# EAGLE design pcb_maquina (EAGLE 7.6.0)

## Sheet 1 of 2
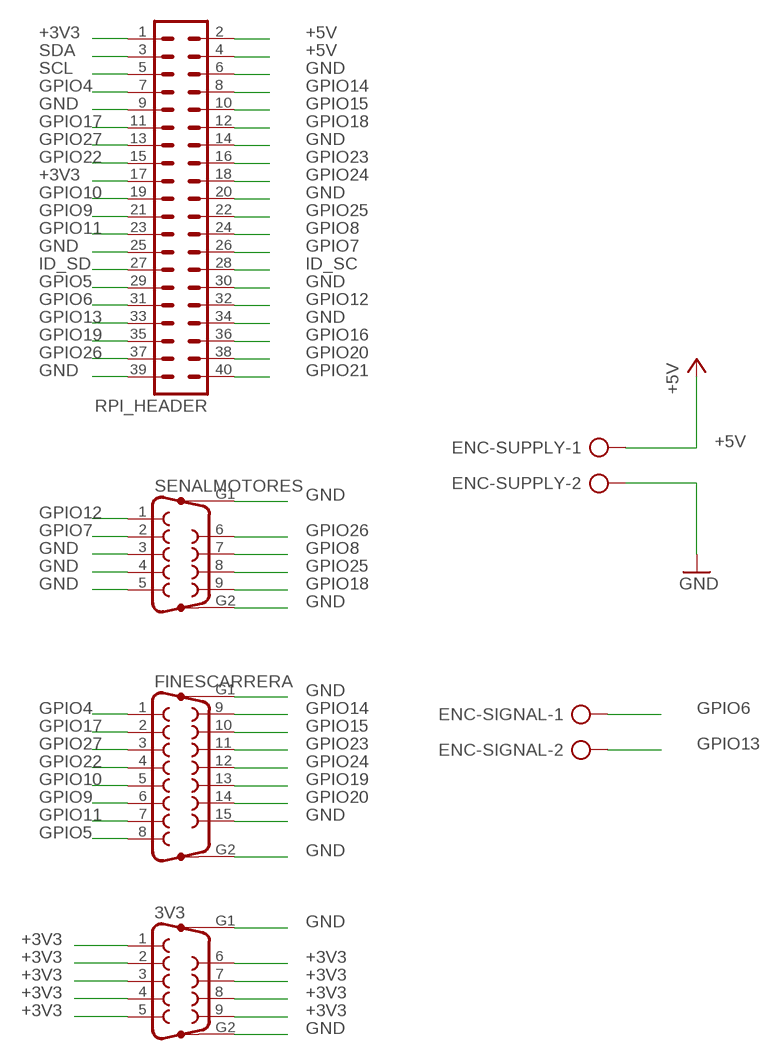
[diagram p0: schematic, sheet 1]

### Parts
3V3  F09HP  [F09HP]
ENC-SIGNAL  AK500/2  [AK500/2]
ENC-SUPPLY  AK500/2  [AK500/2]
FINESCARRERA  F15HP  [F15HP]
RPI_HEADER  MA20-2  [MA20-2]
SENALMOTORES  F09HP  [F09HP]

### Nets
+3V3: 3V3.1 3V3.2 3V3.3 3V3.4 3V3.5 3V3.6 3V3.7 3V3.8 3V3.9 RPI_HEADER.1 RPI_HEADER.17
+5V: ENC-SUPPLY.1 RPI_HEADER.2 RPI_HEADER.4 ; also sheet 2
GND: 3V3.G1 3V3.G2 ENC-SUPPLY.2 FINESCARRERA.15 FINESCARRERA.G1 FINESCARRERA.G2 RPI_HEADER.6 RPI_HEADER.9 RPI_HEADER.14 RPI_HEADER.20 RPI_HEADER.25 RPI_HEADER.30 RPI_HEADER.34 RPI_HEADER.39 SENALMOTORES.3 SENALMOTORES.4 SENALMOTORES.5 SENALMOTORES.G1 SENALMOTORES.G2 ; also sheet 2
GPIO4: FINESCARRERA.1 RPI_HEADER.7
GPIO5: FINESCARRERA.8 RPI_HEADER.29
GPIO6: ENC-SIGNAL.1 RPI_HEADER.31
GPIO7: RPI_HEADER.26 SENALMOTORES.2
GPIO8: RPI_HEADER.24 SENALMOTORES.7
GPIO9: FINESCARRERA.6 RPI_HEADER.21
GPIO10: FINESCARRERA.5 RPI_HEADER.19
GPIO11: FINESCARRERA.7 RPI_HEADER.23
GPIO12: RPI_HEADER.32 SENALMOTORES.1
GPIO13: ENC-SIGNAL.2 RPI_HEADER.33
GPIO14: FINESCARRERA.9 RPI_HEADER.8
GPIO15: FINESCARRERA.10 RPI_HEADER.10
GPIO16: RPI_HEADER.36 ; also sheet 2
GPIO17: FINESCARRERA.2 RPI_HEADER.11
GPIO18: RPI_HEADER.12 SENALMOTORES.9
GPIO19: FINESCARRERA.13 RPI_HEADER.35
GPIO20: FINESCARRERA.14 RPI_HEADER.38
GPIO21: RPI_HEADER.40 ; also sheet 2
GPIO22: FINESCARRERA.4 RPI_HEADER.15
GPIO23: FINESCARRERA.11 RPI_HEADER.16
GPIO24: FINESCARRERA.12 RPI_HEADER.18
GPIO25: RPI_HEADER.22 SENALMOTORES.8
GPIO26: RPI_HEADER.37 SENALMOTORES.6
GPIO27: FINESCARRERA.3 RPI_HEADER.13
ID_SC: RPI_HEADER.28
ID_SD: RPI_HEADER.27
SCL: RPI_HEADER.5 ; also sheet 2
SDA: RPI_HEADER.3 ; also sheet 2

## Sheet 2 of 2
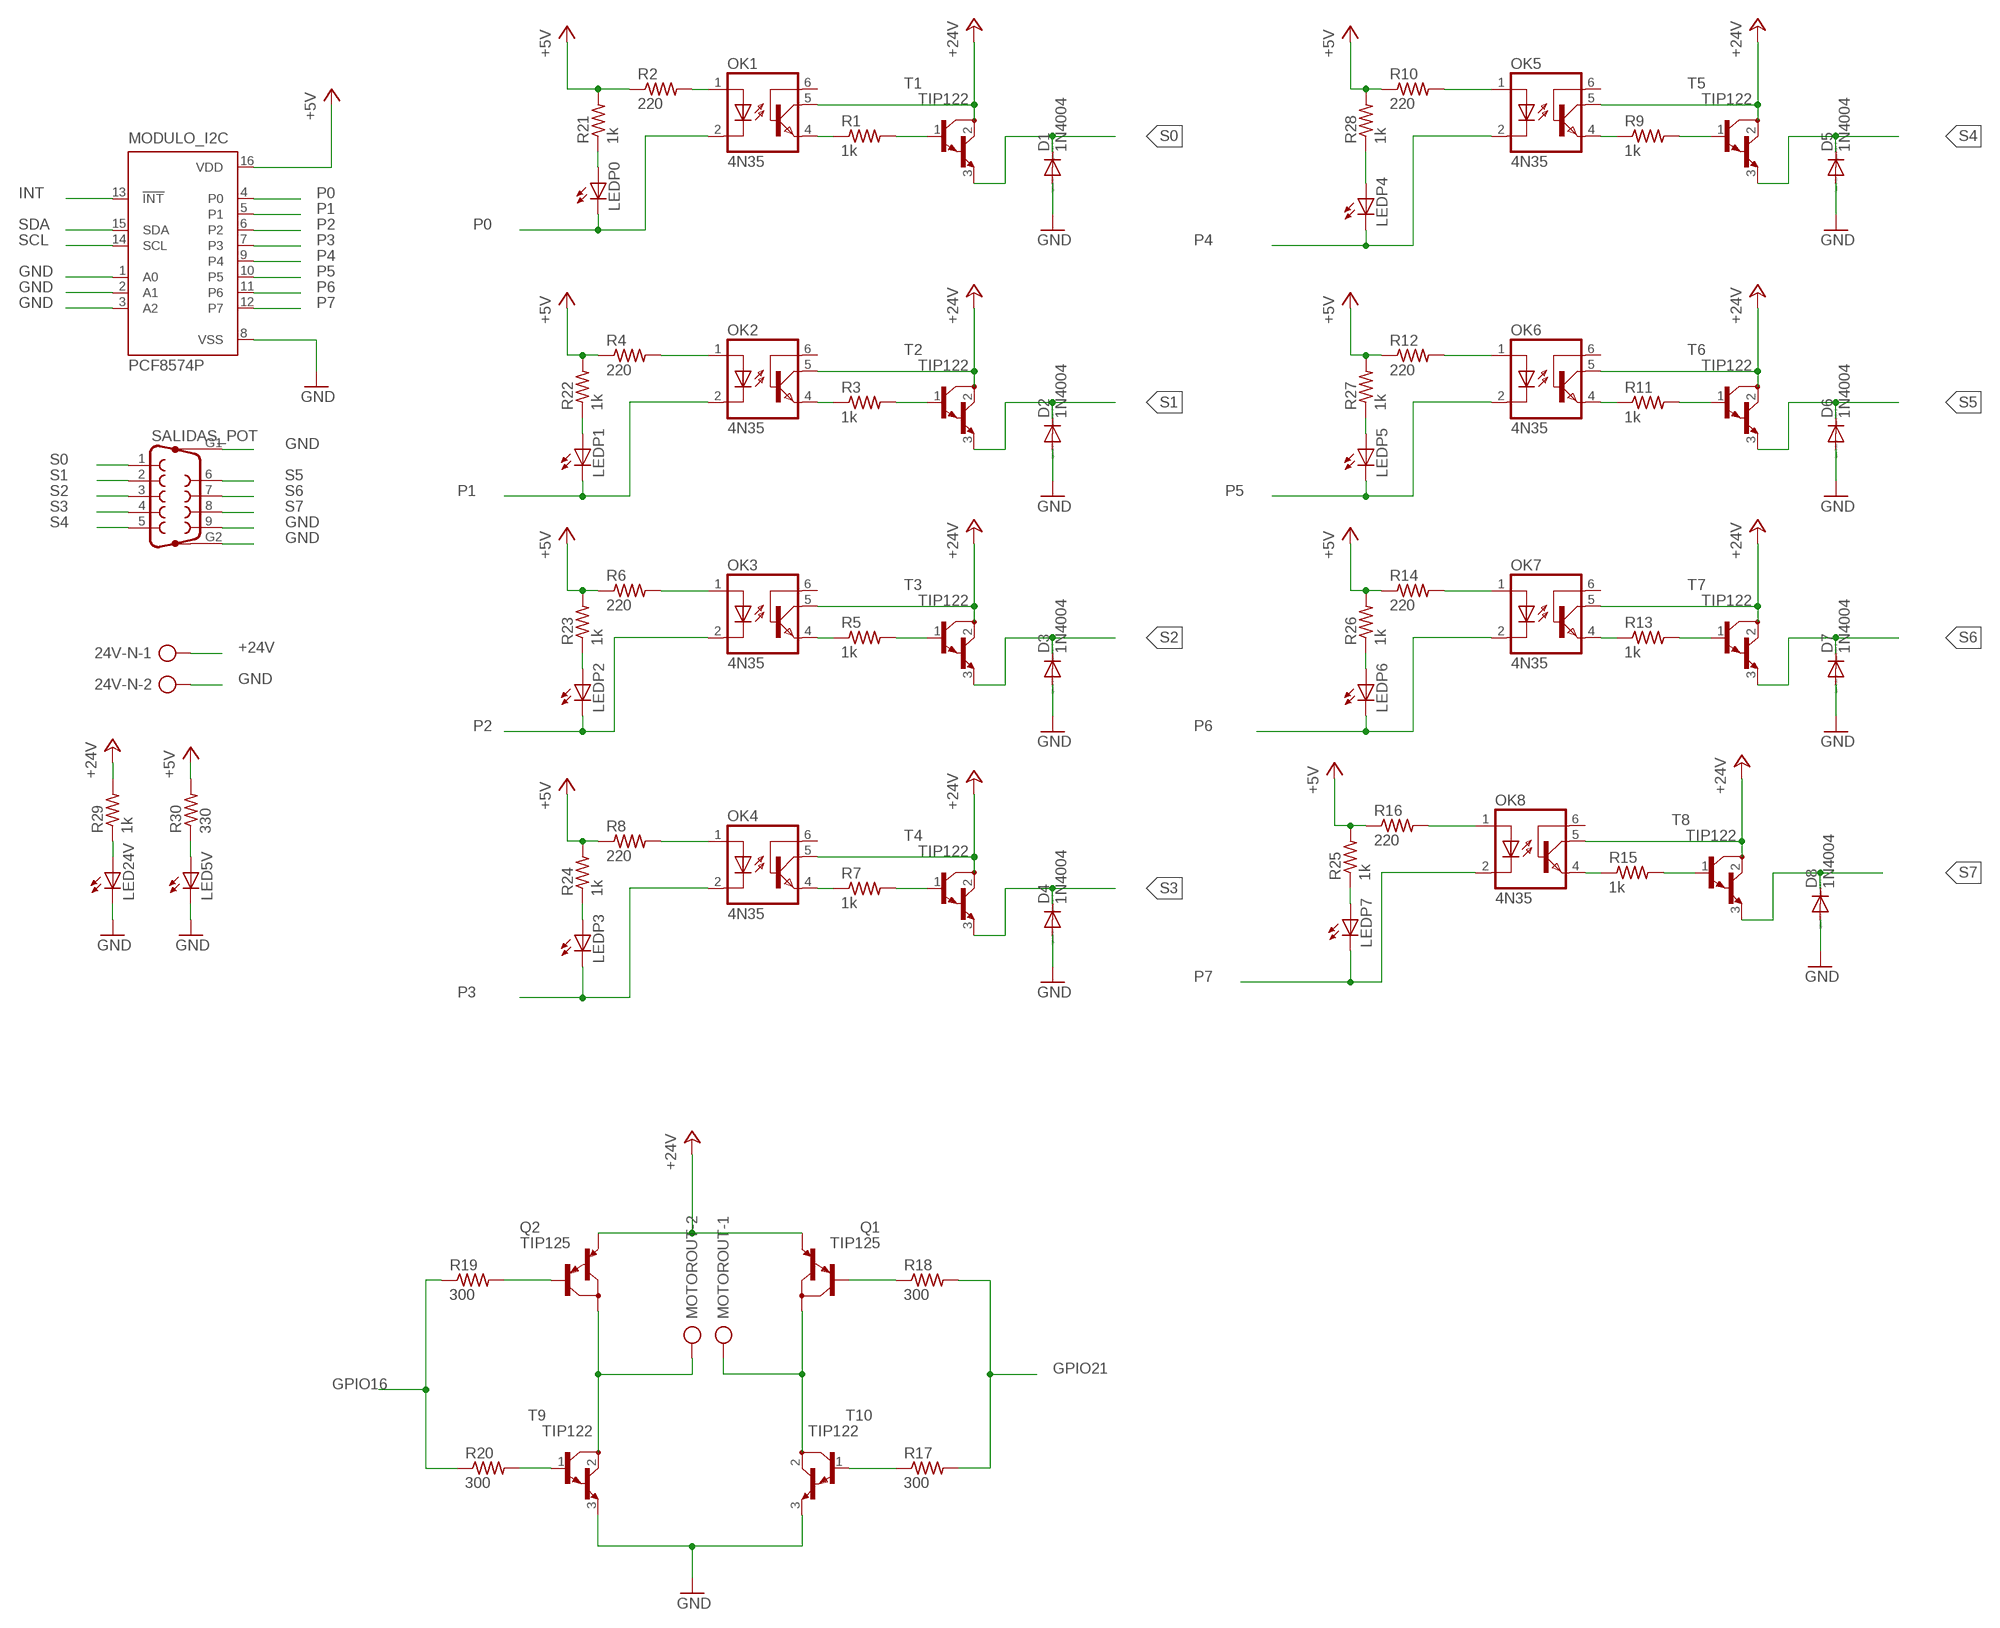
[diagram p1: schematic, sheet 2]

### Parts
24V-N  AK300/2  [AK300/2]
D1  1N4004  [DO41-10]
D2  1N4004  [DO41-10]
D3  1N4004  [DO41-10]
D4  1N4004  [DO41-10]
D5  1N4004  [DO41-10]
D6  1N4004  [DO41-10]
D7  1N4004  [DO41-10]
D8  1N4004  [DO41-10]
LED5V  LED3MM  [LED3MM]
LED24V  LED3MM  [LED3MM]
LEDP0  LED3MM  [LED3MM]
LEDP1  LED3MM  [LED3MM]
LEDP2  LED3MM  [LED3MM]
LEDP3  LED3MM  [LED3MM]
LEDP4  LED3MM  [LED3MM]
LEDP5  LED3MM  [LED3MM]
LEDP6  LED3MM  [LED3MM]
LEDP7  LED3MM  [LED3MM]
MODULO_I2C  PCF8574P  [DIL16]
MOTOROUT  AK300/2  [AK300/2]
OK1  4N35  [DIL06]
OK2  4N35  [DIL06]
OK3  4N35  [DIL06]
OK4  4N35  [DIL06]
OK5  4N35  [DIL06]
OK6  4N35  [DIL06]
OK7  4N35  [DIL06]
OK8  4N35  [DIL06]
Q1  TIP125  [TO220]
Q2  TIP125  [TO220]
R1  1k  R-US_0204/7  [0204/7]
R2  220  R-US_0204/7  [0204/7]
R3  1k  R-US_0204/7  [0204/7]
R4  220  R-US_0204/7  [0204/7]
R5  1k  R-US_0204/7  [0204/7]
R6  220  R-US_0204/7  [0204/7]
R7  1k  R-US_0204/7  [0204/7]
R8  220  R-US_0204/7  [0204/7]
R9  1k  R-US_0204/7  [0204/7]
R10  220  R-US_0204/7  [0204/7]
R11  1k  R-US_0204/7  [0204/7]
R12  220  R-US_0204/7  [0204/7]
R13  1k  R-US_0204/7  [0204/7]
R14  220  R-US_0204/7  [0204/7]
R15  1k  R-US_0204/7  [0204/7]
R16  220  R-US_0204/7  [0204/7]
R17  300  R-US_0204/7  [0204/7]
R18  300  R-US_0204/7  [0204/7]
R19  300  R-US_0204/7  [0204/7]
R20  300  R-US_0204/7  [0204/7]
R21  1k  R-US_0204/7  [0204/7]
R22  1k  R-US_0204/7  [0204/7]
R23  1k  R-US_0204/7  [0204/7]
R24  1k  R-US_0204/7  [0204/7]
R25  1k  R-US_0204/7  [0204/7]
R26  1k  R-US_0204/7  [0204/7]
R27  1k  R-US_0204/7  [0204/7]
R28  1k  R-US_0204/7  [0204/7]
R29  1k  R-US_0204/7  [0204/7]
R30  330  R-US_0204/7  [0204/7]
SALIDAS_POT  F09HP  [F09HP]
T1  TIP122  [TO220]
T2  TIP122  [TO220]
T3  TIP122  [TO220]
T4  TIP122  [TO220]
T5  TIP122  [TO220]
T6  TIP122  [TO220]
T7  TIP122  [TO220]
T8  TIP122  [TO220]
T9  TIP122  [TO220]
T10  TIP122  [TO220]

### Nets
+5V: MODULO_I2C.16(VDD) R2.1 R4.1 R6.1 R8.1 R10.1 R12.1 R14.1 R16.1 R21.2 R22.2 R23.2 R24.2 R25.2 R26.2 R27.2 R28.2 R30.2 ; also sheet 1
+24V [POTENCIA]: 24V-N.1 OK1.5(COL) OK2.5(COL) OK3.5(COL) OK4.5(COL) OK5.5(COL) OK6.5(COL) OK7.5(COL) OK8.5(COL) Q1.3(E) Q2.3(E) R29.2 T1.2(C) T2.2(C) T3.2(C) T4.2(C) T5.2(C) T6.2(C) T7.2(C) T8.2(C)
GND: 24V-N.2 D1.A D2.A D3.A D4.A D5.A D6.A D7.A D8.A LED5V.K(C) LED24V.K(C) MODULO_I2C.1(A0) MODULO_I2C.2(A1) MODULO_I2C.3(A2) MODULO_I2C.8(VSS) SALIDAS_POT.9 SALIDAS_POT.G1 SALIDAS_POT.G2 T9.3(E) T10.3(E) ; also sheet 1
GPIO16: R19.1 R20.1 ; also sheet 1
GPIO21: R17.2 R18.2 ; also sheet 1
INT: MODULO_I2C.13(!INT)
N$1: OK1.1(A) R2.2
N$2: Q1.1(B) R18.1
N$3: Q2.1(B) R19.2
N$4: R20.2 T9.1(B)
N$5 [POTENCIA]: MOTOROUT.2 Q2.2(C) T9.2(C)
N$6 [POTENCIA]: MOTOROUT.1 Q1.2(C) T10.2(C)
N$7: LEDP0.A R21.1
N$8: R17.1 T10.1(B)
N$9: LEDP1.A R22.1
N$10: OK2.1(A) R4.2
N$11: LEDP2.A R23.1
N$12 [POTENCIA]: OK1.4(EMI) R1.1
N$13 [POTENCIA]: R1.2 T1.1(B)
N$14: LEDP3.A R24.1
N$15: LEDP4.A R28.1
N$16 [POTENCIA]: OK2.4(EMI) R3.1
N$17 [POTENCIA]: R3.2 T2.1(B)
N$18: LEDP5.A R27.1
N$19: OK3.1(A) R6.2
N$20: LEDP6.A R26.1
N$21 [POTENCIA]: OK3.4(EMI) R5.1
N$22 [POTENCIA]: R5.2 T3.1(B)
N$23: LEDP7.A R25.1
N$24: OK4.1(A) R8.2
N$25: LED5V.A R30.1
N$26 [POTENCIA]: OK4.4(EMI) R7.1
N$27 [POTENCIA]: R7.2 T4.1(B)
N$28: LED24V.A R29.1
N$29: OK5.1(A) R10.2
N$31 [POTENCIA]: OK5.4(EMI) R9.1
N$32 [POTENCIA]: R9.2 T5.1(B)
N$34: OK6.1(A) R12.2
N$36 [POTENCIA]: OK6.4(EMI) R11.1
N$37 [POTENCIA]: R11.2 T6.1(B)
N$39: OK7.1(A) R14.2
N$41 [POTENCIA]: OK7.4(EMI) R13.1
N$42 [POTENCIA]: R13.2 T7.1(B)
N$44: OK8.1(A) R16.2
N$46 [POTENCIA]: OK8.4(EMI) R15.1
N$47 [POTENCIA]: R15.2 T8.1(B)
P0: LEDP0.K(C) MODULO_I2C.4(P0) OK1.2(C)
P1: LEDP1.K(C) MODULO_I2C.5(P1) OK2.2(C)
P2: LEDP2.K(C) MODULO_I2C.6(P2) OK3.2(C)
P3: LEDP3.K(C) MODULO_I2C.7(P3) OK4.2(C)
P4: LEDP4.K(C) MODULO_I2C.9(P4) OK5.2(C)
P5: LEDP5.K(C) MODULO_I2C.10(P5) OK6.2(C)
P6: LEDP6.K(C) MODULO_I2C.11(P6) OK7.2(C)
P7: LEDP7.K(C) MODULO_I2C.12(P7) OK8.2(C)
S0 [POTENCIA]: D1.C SALIDAS_POT.1 T1.3(E)
S1 [POTENCIA]: D2.C SALIDAS_POT.2 T2.3(E)
S2 [POTENCIA]: D3.C SALIDAS_POT.3 T3.3(E)
S3 [POTENCIA]: D4.C SALIDAS_POT.4 T4.3(E)
S4 [POTENCIA]: D5.C SALIDAS_POT.5 T5.3(E)
S5 [POTENCIA]: D6.C SALIDAS_POT.6 T6.3(E)
S6 [POTENCIA]: D7.C SALIDAS_POT.7 T7.3(E)
S7 [POTENCIA]: D8.C SALIDAS_POT.8 T8.3(E)
SCL: MODULO_I2C.14(SCL) ; also sheet 1
SDA: MODULO_I2C.15(SDA) ; also sheet 1
Unconnected: OK1.6(BAS) OK2.6(BAS) OK3.6(BAS) OK4.6(BAS) OK5.6(BAS) OK6.6(BAS) OK7.6(BAS) OK8.6(BAS)

## Library data of the parts
3V3 SALIDAS_POT SENALMOTORES = con-subd:F09HP: SUB-D; OC_FARNELL: unknown; OC_NEWARK: unknown
24V-N MOTOROUT = con-ptr500:AK300/2: CONNECTOR; OC_FARNELL: unknown; OC_NEWARK: unknown
D1-D8 = diode:1N4004: DIODE general purpose rectifier, 1 A
ENC-SIGNAL ENC-SUPPLY = con-ptr500:AK500/2: CONNECTOR; OC_FARNELL: unknown; OC_NEWARK: unknown
FINESCARRERA = con-subd:F15HP: SUB-D; OC_FARNELL: unknown; OC_NEWARK: unknown
LED5V LED24V LEDP0 LEDP1-LEDP7 = led:LED: LED OSRAM: - CHIPLED LG R971, LG N971, LY N971, LG Q971, LY Q971, LO R971, LY R971 LH N974, LH R974 LS Q976, LO Q976, LY Q976 LO Q996 - Hyper CHIPLED LW Q18S LB Q993, LB Q99A, LB R99A - SideLED LS A670, LO A670, LY A670, LG A670, LP A670 LB A673, LV A673, LT A673, LW A673 LH A674 LY A675 LS A676, LA A676, LO A676, LY A676, LW A676 LS A679, LY A679, LG A679 - Hyper Micro SIDELED® LS Y876, LA Y876, LO Y876, LY Y876 LT Y87S - SmartLED LW L88C, LW L88S LB L89C, LB L89S, LG L890 LS L89K, LO L89K, LY L89K LS L896, LA L896, LO L896, LY L896 - TOPLED LS T670, LO T670, LY T670, LG T670, LP T670 LSG T670, LSP T670, LSY T670, LOP T670, LYG T670 LG T671, LOG T671, LSG T671 LB T673, LV T673, LT T673, LW T673 LH T674 LS T676, LA T676, LO T676, LY T676, LB T676, LH T676, LSB T676, LW T676 LB T67C, LV T67C, LT T67C, LS T67K, LO T67K, LY T67K, LW E67C LS E67B, LA E67B, LO E67B, LY E67B, LB E67C, LV E67C, LT E67C LW T67C LS T679, LY T679, LG T679 LS T770, LO T770, LY T770, LG T770, LP T770 LB T773, LV T773, LT T773, LW T773 LH T774 LS E675, LA E675, LY E675, LS T675 LS T776, LA T776, LO T776, LY T776, LB T776 LHGB T686 LT T68C, LB T68C - Hyper Mini TOPLED® LB M676 - Mini TOPLED Santana® LG M470 LS M47K, LO M47K, LY M47K Source: http://www.osram.convergy.de LUXEON: - LUMILED® LXK2-PW12-R00, LXK2-PW12-S00, LXK2-PW14-U00, LXK2-PW14-V00 LXK2-PM12-R00, LXK2-PM12-S00, LXK2-PM14-U00 LXK2-PE12-Q00, LXK2-PE12-R00, LXK2-PE12-S00, LXK2-PE14-T00, LXK2-PE14-U00 LXK2-PB12-K00, LXK2-PB12-L00, LXK2-PB12-M00, LXK2-PB14-N00, LXK2-PB14-P00, LXK2-PB14-Q00 LXK2-PR12-L00, LXK2-PR12-M00, LXK2-PR14-Q00, LXK2-PR14-R00 LXK2-PD12-Q00, LXK2-PD12-R00, LXK2-PD12-S00 LXK2-PH12-R00, LXK2-PH12-S00 LXK2-PL12-P00, LXK2-PL12-Q00, LXK2-PL12-R00 Source: www.luxeon.com KINGBRIGHT: KA-3528ASYC Source: www.kingbright.com
MODULO_I2C = micro-philips:PCF8574: I2C-Bus Remote 8-bit I/O expander http://www.semiconductors.philips.com/acrobat_download/datasheets/PCF8574_4.pdf; MPN: PCF8574PN; OC_FARNELL: 204020; OC_NEWARK: 11N8515
OK1-OK8 = optocoupler:4N35: MOTOROLA OPTO COUPLER; MF: FAIRCHILD SEMICONDUCTOR; MPN: 4N35; OC_FARNELL: 1328375; OC_NEWARK: 72K9946
Q1 Q2 = transistor-pnp:TIP125: PNP Transistor
R1-R30 = resistor:R-US_: RESISTOR, American symbol
RPI_HEADER = con-lstb:MA20-2: PIN HEADER; OC_FARNELL: unknown; OC_NEWARK: unknown
T1-T10 = transistor:TIP122: NPN BIPOLAR DARLINGTON TRANSISTOR

## Net classes
0 default: width 0.406 mm
1 POTENCIA: width 0.635 mm, clearance 0.254 mm

## Board
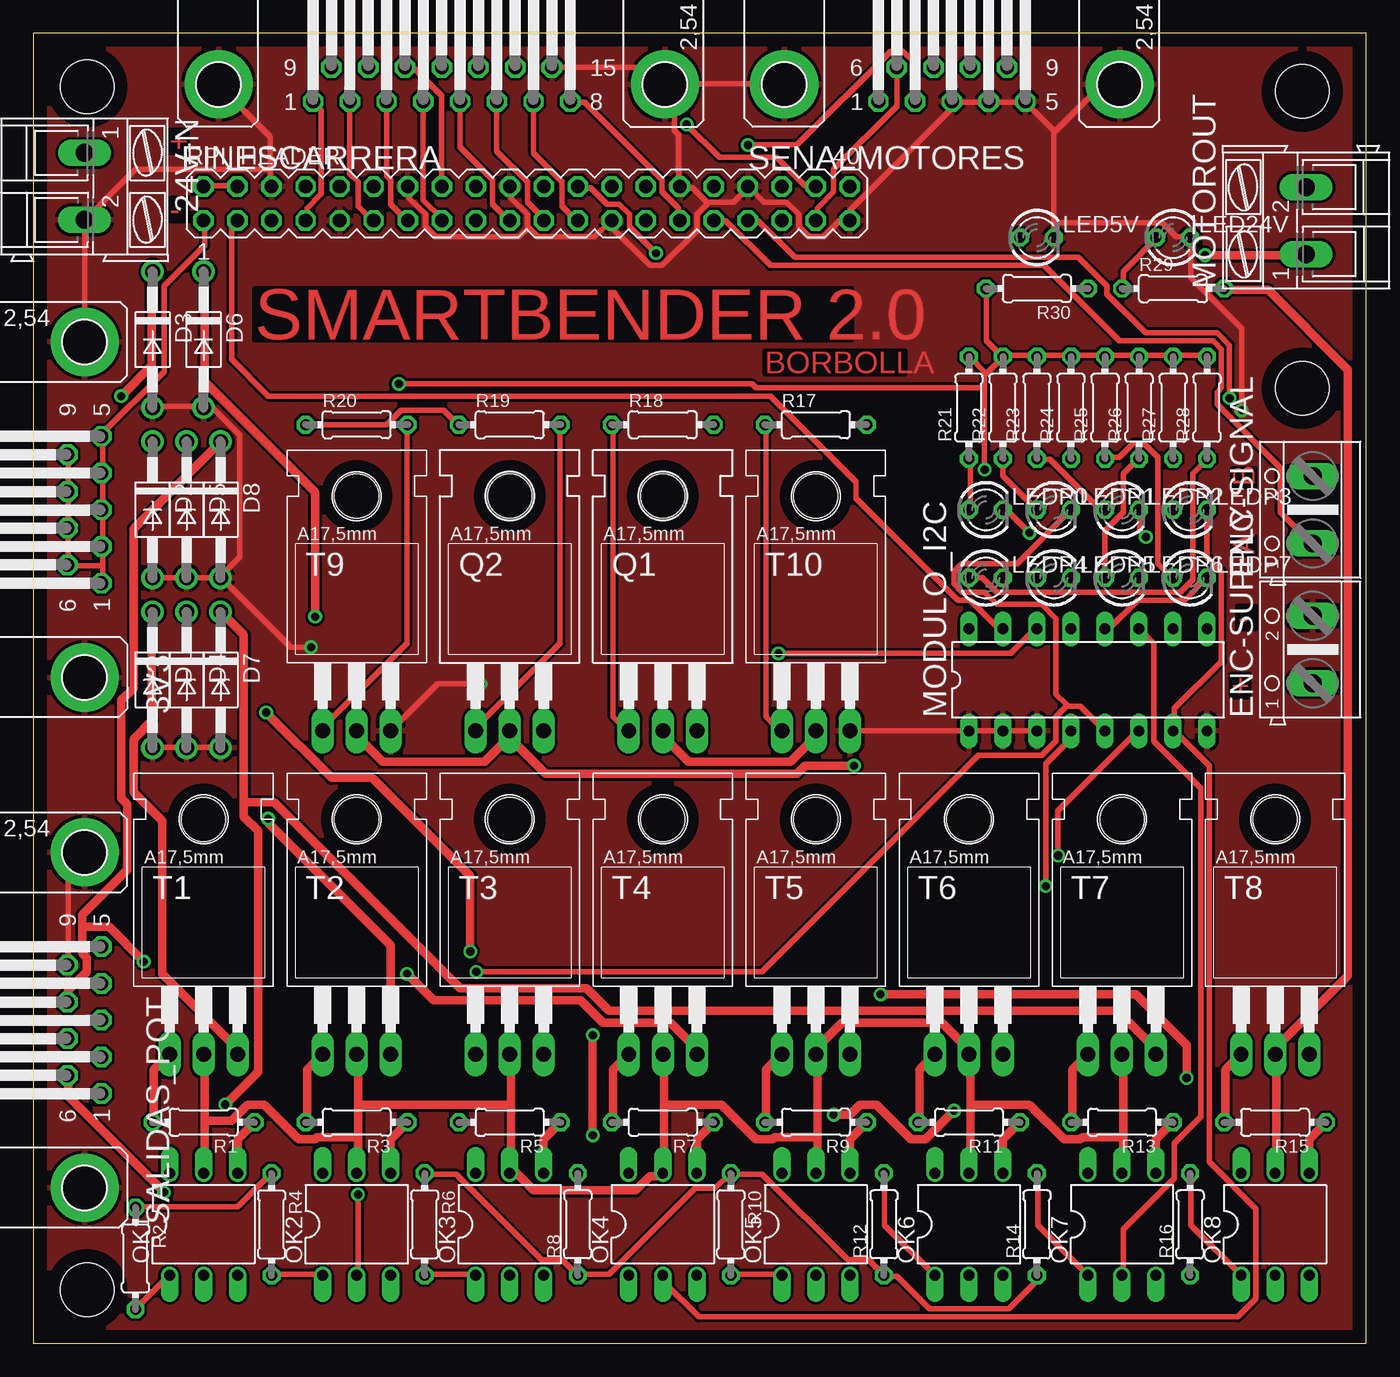
[diagram p2: board, top side]
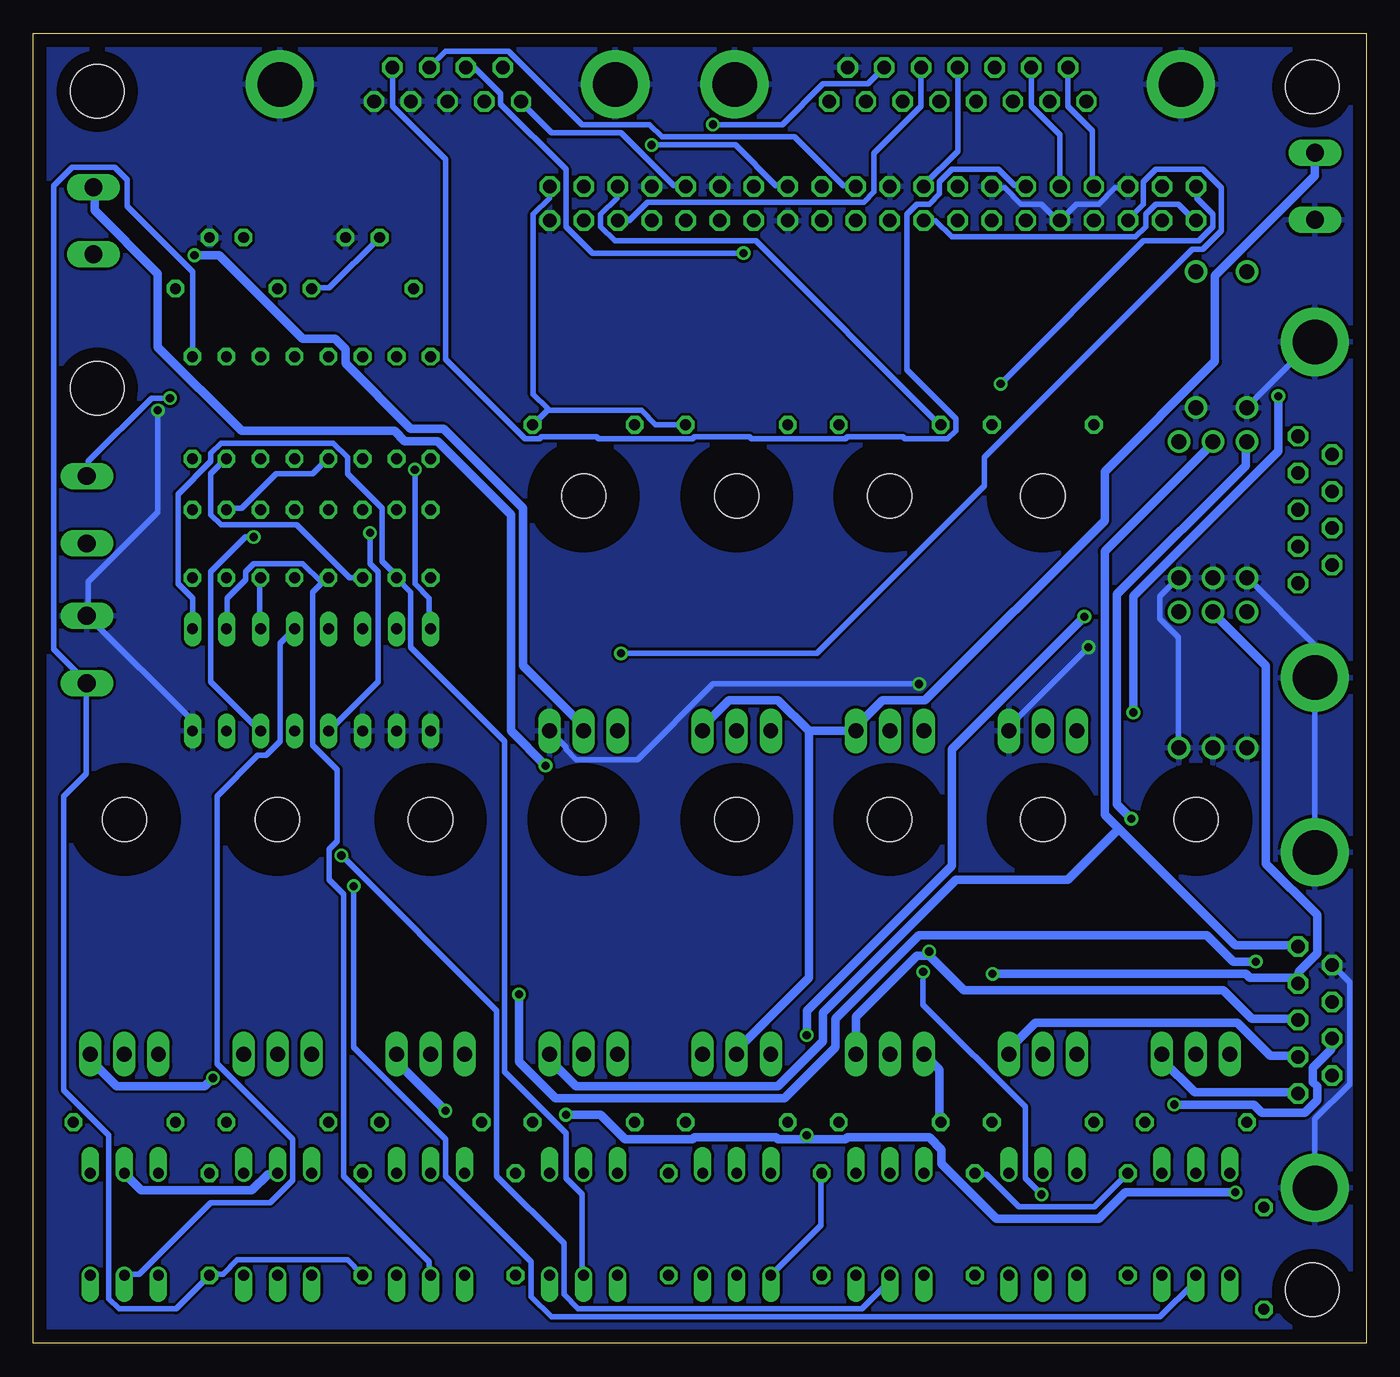
[diagram p3: board, bottom side, seen from below]

Size 99.5 x 97.78 mm. Coordinates in mm from the lower left corner, seen from the top.
Outline: 0,0 99.5,0 99.5,97.78 0,97.78 0,0
Copper layers (1*16): Top 0.035mm / dielectric 1.5mm / Bottom 0.035mm
Design rules "default": minimum track width 10mil, minimum drill 24mil, track to track 8mil, track to pad 8mil, pad to pad 8mil, via to via 8mil, smd to smd 8mil, copper to edge 40mil, drill to drill 8mil, minimum pad ring 10mil, minimum via ring 8mil, stop-mask expansion 4mil, vias tented up to drill 0mil, thermal gap 10mil
Holes 4 mm at 4,93.8 4,4 94.73,71.31 94.73,93.46

### Footprints (pad centres in the part's own frame; a part is rotated, then mirrored left to right if it is on the bottom)
F09HP = drill 1.016 octagon: 1 -5.486,-1.27; 2 -2.743,-1.27; 3 0,-1.27; 4 2.743,-1.27; 5 5.486,-1.27; 6 -4.115,1.27; 7 -1.372,1.27; 8 1.372,1.27; 9 4.115,1.27 | drill 3.302 pad 5.08: G1 -12.522,0; G2 12.522,0
AK300/2 = drill 1.321 long: 1 -2.515,0; 2 2.489,0
DO41-10 = drill 1.118: A 5.08,0; C -5.08,0
AK500/2 = drill 1.321 long: 1 -2.515,0; 2 2.515,0
F15HP = drill 1.016 octagon: 1 -9.601,-1.27; 2 -6.858,-1.27; 3 -4.115,-1.27; 4 -1.372,-1.27; 5 1.372,-1.27; 6 4.115,-1.27; 7 6.858,-1.27; 8 9.601,-1.27; 9 -8.23,1.27; 10 -5.486,1.27; 11 -2.743,1.27; 12 0,1.27; 13 2.743,1.27; 14 5.486,1.27; 15 8.23,1.27 | drill 3.302 pad 5.08: G1 -16.662,0; G2 16.662,0
LED3MM = drill 0.813 octagon: A -1.27,0; K 1.27,0
DIL16 = drill 0.813 long: 1 -8.89,-3.81; 2 -6.35,-3.81; 3 -3.81,-3.81; 4 -1.27,-3.81; 5 1.27,-3.81; 6 3.81,-3.81; 7 6.35,-3.81; 8 8.89,-3.81; 9 8.89,3.81; 10 6.35,3.81; 11 3.81,3.81; 12 1.27,3.81; 13 -1.27,3.81; 14 -3.81,3.81; 15 -6.35,3.81; 16 -8.89,3.81
DIL06 = drill 0.813 offset: 1 -2.54,-3.81; 2 0,-3.81; 3 2.54,-3.81; 4 2.54,3.81; 5 0,3.81; 6 -2.54,3.81
TO220 = drill 1.118 long: 1 -2.54,-6.35; 2 0,-6.35; 3 2.54,-6.35 | hole 3.302: 0,11.176
0204/7 = drill 0.813 octagon: 1 -3.81,0; 2 3.81,0
MA20-2 = drill 1.016 octagon: 1 -24.13,-1.27; 2 -24.13,1.27; 3 -21.59,-1.27; 4 -21.59,1.27; 5 -19.05,-1.27; 6 -19.05,1.27; 7 -16.51,-1.27; 8 -16.51,1.27; 9 -13.97,-1.27; 10 -13.97,1.27; 11 -11.43,-1.27; 12 -11.43,1.27; 13 -8.89,-1.27; 14 -8.89,1.27; 15 -6.35,-1.27; 16 -6.35,1.27; 17 -3.81,-1.27; 18 -3.81,1.27; 19 -1.27,-1.27; 20 -1.27,1.27; 21 1.27,-1.27; 22 1.27,1.27; 23 3.81,-1.27; 24 3.81,1.27; 25 6.35,-1.27; 26 6.35,1.27; 27 8.89,-1.27; 28 8.89,1.27; 29 11.43,-1.27; 30 11.43,1.27; 31 13.97,-1.27; 32 13.97,1.27; 33 16.51,-1.27; 34 16.51,1.27; 35 19.05,-1.27; 36 19.05,1.27; 37 21.59,-1.27; 38 21.59,1.27; 39 24.13,-1.27; 40 24.13,1.27

### Placement (x,y rotation side)
3V3  3.81,62.23 90 top
24V-N  3.81,86.36 270 top
D1  8.89,49.53 270 top
D2  8.89,62.23 270 top
D3  8.89,74.93 270 top
D4  11.43,49.53 270 top
D5  11.43,62.23 270 top
D6  12.7,74.93 270 top
D7  13.97,49.53 270 top
D8  13.97,62.23 270 top
ENC-SIGNAL  95.52,62.23 90 top
ENC-SUPPLY  95.52,51.8 90 top
FINESCARRERA  30.48,93.98 0 top
LED5V  74.93,82.55 0 top
LED24V  85.09,82.55 0 top
LEDP0  71.12,62.23 0 top
LEDP1  76.2,62.23 0 top
LEDP2  81.28,62.23 0 top
LEDP3  86.36,62.23 0 top
LEDP4  71.12,57.15 0 top
LEDP5  76.2,57.15 0 top
LEDP6  81.28,57.15 0 top
LEDP7  86.36,57.15 0 top
MODULO_I2C  78.74,49.53 0 top
MOTOROUT  95.02,83.82 90 top
OK1  12.7,8.89 0 top
OK2  24.13,8.89 0 top
OK3  35.56,8.89 0 top
OK4  46.99,8.89 0 top
OK5  58.42,8.89 0 top
OK6  69.85,8.89 0 top
OK7  81.28,8.89 0 top
OK8  92.71,8.89 0 top
Q1  46.99,52.07 0 top
Q2  35.56,52.07 0 top
R1  12.7,16.51 180 top
R2  7.62,6.35 270 top
R3  24.13,16.51 180 top
R4  17.78,8.89 270 top
R5  35.56,16.51 180 top
R6  29.21,8.89 270 top
R7  46.99,16.51 180 top
R8  40.64,8.89 90 top
R9  58.42,16.51 180 top
R10  52.07,8.89 270 top
R11  69.85,16.51 180 top
R12  63.5,8.89 90 top
R13  81.28,16.51 180 top
R14  74.93,8.89 90 top
R15  92.71,16.51 180 top
R16  86.36,8.89 90 top
R17  58.42,68.58 0 top
R18  46.99,68.58 0 top
R19  35.56,68.58 0 top
R20  24.13,68.58 0 top
R21  69.85,69.85 90 top
R22  72.39,69.85 90 top
R23  74.93,69.85 90 top
R24  77.47,69.85 90 top
R25  80.01,69.85 90 top
R26  82.55,69.85 90 top
R27  85.09,69.85 90 top
R28  87.63,69.85 90 top
R29  85.09,78.74 0 top
R30  74.93,78.74 180 top
RPI_HEADER  36.83,85.09 0 top
SALIDAS_POT  3.81,24.13 90 top
SENALMOTORES  68.58,93.98 0 top
T1  12.7,27.94 0 top
T2  24.13,27.94 0 top
T3  35.56,27.94 0 top
T4  46.99,27.94 0 top
T5  58.42,27.94 0 top
T6  69.85,27.94 0 top
T7  81.28,27.94 0 top
T8  92.71,27.94 0 top
T9  24.13,52.07 0 top
T10  58.42,52.07 0 top

### Tracks (layer width: path | path; a pad name or v marks a point on that pad's centre or on a via)
+3V3
  Top 0.406: 5.18,58.06 5.18,59.44 3V3.2 5.18,59.59 5.18,62.18 3V3.3 5.18,62.33 5.18,64.92 3V3.4 5.18,65.08 5.18,67.67 3V3.5 5.03,67.82 9.75,72.54 9.75,78.94 12.8,81.99 12.8,83.82 RPI_HEADER.1 | 5.18,58.06 5.18,56.84 3V3.1 | 5.18,58.06 2.59,58.06 3V3.6 2.59,58.22 2.59,60.81 3V3.7 2.59,60.96 2.59,63.55 3V3.8 2.59,63.7 2.59,66.29 3V3.9
  Bottom 0.406: RPI_HEADER.17 32.16,83.82 30.94,82.6 17.22,82.6 16.46,83.36 16.46,84.28 15.7,85.04 14.02,85.04 12.8,83.82 RPI_HEADER.1
+5V  (via drill 0.61)
  Top 0.406: R28.2 87.63,73.76 85.19,73.76 R27.2 85.04,73.76 82.6,73.76 R26.2 82.45,73.76 80.16,73.76 R25.2 80.01,73.76 77.57,73.76 R24.2 77.42,73.76 74.98,73.76 R23.2 74.83,73.76 72.54,73.76 R22.2 | RPI_HEADER.2 12.8,86.41 15.24,86.41 RPI_HEADER.4 | 71.02,72.39 71.02,72.54 69.95,73.61 R21.2 | 71.02,72.39 71.02,71.32 | 71.02,71.32 v71.02,65.23 | R22.2 72.39,73.61 71.17,72.39 71.02,72.39 | R30.2 71.17,78.64 71.17,74.83 72.24,73.76 R22.2 | v27.28,71.63 53.65,71.63 53.95,71.32 71.02,71.32 | R2.1 7.62,10.21 15.24,10.21 17.68,12.65 R4.1 | R14.1 74.83,5.03 74.83,4.57 72.85,2.59 66.9,2.59 64.47,5.03 63.55,5.03 R12.1 62.33,6.25 60.81,6.25 54.41,12.65 52.12,12.65 R10.1 51.97,12.65 50.9,11.58 49.38,11.58 42.98,5.18 40.69,5.18 R8.1 39.47,6.25 37.95,6.25 31.55,12.65 29.26,12.65 R6.1
  Bottom 0.406: v71.02,65.23 71.02,56.69 69.95,55.63 69.95,53.34 MODULO_I2C.16 | v27.28,71.63 16.61,82.3 12.5,82.3 11.43,83.36 11.43,84.28 12.65,85.5 12.65,86.26 RPI_HEADER.2 | R4.1 20.27,10.21 25.91,10.21 28.35,12.65 29.11,12.65 R6.1 | R14.1 74.98,5.18 76.05,6.25 84.28,6.25 85.34,5.18 86.26,5.18 R16.1 88.85,2.59 93.12,2.59 93.88,3.35 93.88,15.54 97.23,18.9 97.23,40.84 95.56,42.52 95.56,49.23 ENC-SUPPLY.1 95.56,49.38 97.99,51.82 97.99,86.41 96.62,87.78 93.42,87.78 92.51,86.87 92.51,84.89 87.63,80.01 R28.2
+24V
  Top 0.635: 58.52,15.39 58.52,21.49 T5.2 58.52,21.79 58.52,22.1 60.35,23.93 67.82,23.93 69.95,21.79 T6.2 69.95,21.49 69.95,17.83 | 58.52,15.39 58.52,12.8 OK5.5 | 47.09,17.83 47.09,21.49 T4.2 | 47.09,17.83 47.09,12.8 OK4.5 46.79,12.5 46.02,12.5 44.96,11.43 37.34,11.43 35.97,12.8 OK3.5 35.66,12.8 35.66,17.83 | 35.66,17.83 35.66,21.49 T3.2 | 12.8,16.61 12.8,21.49 T1.2 | 12.8,16.61 12.8,12.8 OK1.5 | 24.23,17.83 24.23,21.49 T2.2 | 24.23,17.83 24.23,15.39 | 24.23,15.39 24.23,12.8 OK2.5 | 12.8,16.61 14.78,16.61 16,17.83 17.22,17.83 19.81,15.24 21.03,15.24 21.18,15.39 24.23,15.39 | 24.23,17.83 35.66,17.83 | 58.52,15.39 55.32,15.39 55.17,15.24 53.95,15.24 51.36,17.83 47.09,17.83 | 69.95,17.83 69.95,12.8 OK6.5 | 81.38,15.39 81.38,21.49 T7.2 | 81.38,15.39 81.38,12.8 OK7.5 | 69.95,17.83 74.37,17.83 76.96,15.24 78.18,15.24 78.33,15.39 81.38,15.39 | OK8.5 92.81,12.8 92.81,21.49 T8.2 92.51,21.79 98.15,27.43 98.15,72.69 92.2,78.64 89,78.64 R29.2
  Bottom 0.635: 41.6,45.72 Q2.3 38.1,46.02 36.12,48.01 32.92,48.01 19.51,61.42 19.51,65.08 11.28,73.3 11.28,79.7 3.81,87.17 24V-N.1 | 41.6,45.72 43.89,48.01 47.55,48.01 49.53,46.02 Q1.3 | OK8.5 91.44,11.43 83.21,11.43 81.99,12.65 81.38,12.65 OK7.5 | 41.6,45.72 41.6,27.28 46.94,21.95 46.94,21.64 T4.2
GND  (via drill 0.61)
  Top 0.406: 17.68,87.63 17.68,90.07 13.87,93.88 FINESCARRERA.G1 | 17.68,87.63 17.68,86.41 RPI_HEADER.6 | 36.88,83.36 36.88,84.28 35.66,85.5 35.66,86.26 RPI_HEADER.20 | 36.88,83.36 37.64,82.6 41.91,82.6 43.13,83.82 RPI_HEADER.25 42.98,83.52 46.02,80.47 46.94,80.47 49.53,83.06 49.53,84.28 50.29,85.04 50.29,85.19 | 50.29,85.19 49.23,86.26 48.31,86.26 RPI_HEADER.30 48.16,86.41 48.16,90.22 47.85,90.53 47.85,93.88 FINESCARRERA.G2 | 50.29,85.19 52.27,85.19 53.34,86.26 RPI_HEADER.34 53.49,86.26 54.56,85.19 56.24,85.19 57.15,84.28 57.15,83.36 57.91,82.6 58.98,82.6 60.2,83.82 RPI_HEADER.39 60.96,84.58 68.89,92.51 SENALMOTORES.3 68.58,92.66 71.32,92.66 SENALMOTORES.4 71.48,92.66 73.91,92.66 SENALMOTORES.5 74.07,92.66 76.2,90.53 | FINESCARRERA.15 45.87,95.25 FINESCARRERA.G2 | SENALMOTORES.G1 55.93,94.03 47.24,94.03 FINESCARRERA.G2 | RPI_HEADER.14 28.04,86.26 28.04,85.5 29.26,84.28 29.26,83.36 30.02,82.6 36.27,82.6 36.88,83.21 36.88,83.36 | 76.2,90.53 76.2,83.67 | 76.2,83.67 LED5V.K | 76.2,83.67 84.28,83.67 85.34,82.6 86.26,82.6 LED24V.K 86.41,82.45 86.41,79.55 90.22,75.74 v90.22,69.65 | SENALMOTORES.G2 81.08,93.88 79.7,93.88 76.35,90.53 76.2,90.53 | SALIDAS_POT.9 2.59,28.35 2.59,35.36 3.81,36.58 SALIDAS_POT.G2 | D3.A 8.99,69.95 12.65,69.95 D6.A 12.8,69.8 13.41,69.8 15.39,67.82 15.39,58.67 14.02,57.3 D8.A | 3V3.G2 24V-N.2 3.96,83.97 7.62,87.63 17.68,87.63 | MODULO_I2C.3 MODULO_I2C.2 MODULO_I2C.1 T10.3 | D1.A 8.99,44.5 11.43,44.5 D4.A 11.58,44.5 13.87,44.5 D7.A | D2.A D5.A D8.A | v20.73,51.97 19.2,51.97 14.02,57.15 D8.A | v33.38,49.23 30.18,49.23 T9.3
  Bottom 0.406: RPI_HEADER.6 17.83,86.26 18.75,86.26 19.96,85.04 21.64,85.04 RPI_HEADER.9 23.01,83.82 24.23,85.04 25.76,85.04 26.98,86.26 27.89,86.26 RPI_HEADER.14 | MODULO_I2C.8 87.63,46.48 95.4,54.25 ENC-SUPPLY.2 95.4,54.41 95.4,56.84 90.22,62.03 v90.22,69.65 | SALIDAS_POT.G1 3.81,16.76 1.22,19.36 1.22,26.98 2.44,28.19 SALIDAS_POT.9 | D3.A 8.84,69.95 4.12,74.68 3.81,74.68 3V3.G2 | T9.3 26.67,46.02 v20.73,51.97 | D7.A 14.02,44.5 14.02,52.73 15.39,54.1 15.39,55.78 14.02,57.15 D8.A | T10.3 59.74,44.5 59.74,44.35 58.98,43.59 54.41,43.59 48.77,49.23 v33.38,49.23 | D2.A 8.84,57.15 3.81,52.12 3V3.G1 SALIDAS_POT.G2
  pour Bottom: -0.5,-0.5 -1,-0.5 -1,99 101.5,99 102,99 102,-2 -0.5,-2
  pour Top: -5,101 -5,-8 106.5,-8 111,-8 111,101
GPIO4
  Top 0.406: RPI_HEADER.7 20.42,83.82 20.42,84.73 21.49,85.8 21.49,92.05 20.88,92.66 FINESCARRERA.1
GPIO5
  Top 0.406: RPI_HEADER.29 48.16,83.82 48.16,84.73 46.94,85.95 46.94,86.87 41.15,92.66 40.08,92.66 FINESCARRERA.8
GPIO6
  Top 0.406: RPI_HEADER.31 51.66,83.82 55.02,80.47 75.44,80.47 81.08,74.83 88.09,74.83 88.7,74.22 88.7,71.32 88.39,71.02 88.39,70.1 93.12,65.38 93.12,62.03 95.4,59.74 ENC-SIGNAL.1
GPIO7  (via drill 0.61)
  Top 0.406: v53.34,89.46 57,89.46 64.01,96.47 64.92,96.47 65.84,95.56 SENALMOTORES.2
  Bottom 0.406: v53.34,89.46 47.09,89.46 44.04,86.41 43.28,86.41 RPI_HEADER.26
GPIO8  (via drill 0.61)
  Top 0.406: v46.48,81.38 44.5,83.36 44.5,84.28 43.74,85.04 42.82,85.04 41.6,86.26 40.69,86.26 RPI_HEADER.24
  Bottom 0.406: v46.48,81.38 57.76,81.38 59.74,83.36 59.74,87.63 64.62,92.51 64.62,93.27 66.6,95.25 SENALMOTORES.7
GPIO9
  Top 0.406: FINESCARRERA.6 34.59,89 36.88,86.72 36.88,85.19 38.1,83.97 RPI_HEADER.21
GPIO10
  Top 0.406: FINESCARRERA.5 31.85,89.31 34.29,86.87 34.29,85.04 35.51,83.82 RPI_HEADER.19
GPIO11
  Top 0.406: FINESCARRERA.7 37.34,88.85 39.47,86.72 39.47,84.89 40.54,83.82 RPI_HEADER.23
GPIO12
  Bottom 0.406: RPI_HEADER.32 50.9,86.41 51.66,86.41 55.63,90.37 60.81,90.37 63.09,92.66 SENALMOTORES.1
GPIO13  (via drill 0.61)
  Top 0.406: RPI_HEADER.33 54.1,83.82 56.84,81.08 78.03,81.08 80.16,78.94 80.16,78.33 83.06,75.44 88.39,75.44 89.31,74.52 v89.31,70.56
  Bottom 0.406: v89.31,70.56 90.68,70.56 95.4,65.84 95.4,64.77 ENC-SIGNAL.2
GPIO14
  Bottom 0.406: FINESCARRERA.9 22.25,92.35 20.42,90.53 20.42,86.41 RPI_HEADER.8
GPIO15
  Bottom 0.406: RPI_HEADER.10 22.86,90.22 24.99,92.35 FINESCARRERA.10
GPIO16
  Top 0.406: R20.1 26.36,68.58 27.43,69.65 30.63,69.65 31.7,68.58 R19.1
  Bottom 0.406: RPI_HEADER.36 55.93,86.26 55.93,85.5 57.15,84.28 57.15,83.36 56.08,82.3 45.57,82.3 31.85,68.58 R19.1
GPIO17
  Top 0.406: FINESCARRERA.2 23.62,87.33 24.23,86.72 24.23,84.89 25.3,83.82 RPI_HEADER.11
GPIO18
  Bottom 0.406: SENALMOTORES.9 72.69,92.35 68.73,88.39 68.73,73.46 62.79,67.51 61.72,67.51 61.57,67.67 57.45,67.67 57.3,67.51 50.29,67.51 50.14,67.67 46.02,67.67 45.87,67.51 38.86,67.51 38.71,67.67 34.59,67.67 34.44,67.51 31.24,67.51 30.63,68.12 30.63,69.04 34.29,72.69 34.29,84.28 33.53,85.04 32.61,85.04 31.85,85.8 31.85,86.72 30.94,87.63 27.43,87.63 26.21,86.41 25.45,86.41 RPI_HEADER.12
GPIO19
  Bottom 0.406: RPI_HEADER.35 55.02,83.82 53.65,85.19 37.49,85.19 36.73,85.95 36.73,88.85 33.22,92.35 FINESCARRERA.13
GPIO20  (via drill 0.61)
  Top 0.406: v48.77,90.98 51.21,88.54 55.47,88.54 57.61,86.41 58.37,86.41 RPI_HEADER.38
  Bottom 0.406: v48.77,90.98 43.59,90.98 40.54,94.03 37.19,94.03 FINESCARRERA.14
GPIO21
  Bottom 0.406: R18.2 53.03,68.58 54.1,69.65 61.11,69.65 | 61.11,69.65 62.18,68.58 R17.2 | RPI_HEADER.40 60.96,85.5 62.18,84.28 62.18,70.87 61.11,69.8 61.11,69.65
GPIO22
  Top 0.406: FINESCARRERA.4 29.11,85.34 30.48,83.97 RPI_HEADER.15
GPIO23
  Top 0.406: FINESCARRERA.11 28.35,95.25 30.48,93.12 RPI_HEADER.16
GPIO24
  Bottom 0.406: FINESCARRERA.12 30.48,89 33.07,86.41 RPI_HEADER.18
GPIO25
  Bottom 0.406: SENALMOTORES.8 68.73,96.47 64.01,96.47 58.52,90.98 53.49,90.98 52.58,90.07 42.67,90.07 39.01,86.41 38.1,86.41 RPI_HEADER.22
GPIO26
  Top 0.406: SENALMOTORES.6 64.47,92.35 59.74,87.63 59.74,85.95 58.52,84.73 58.52,83.82 RPI_HEADER.37
GPIO27
  Top 0.406: FINESCARRERA.3 26.36,87.17 26.67,86.87 26.67,85.04 27.89,83.82 RPI_HEADER.13
N$1
  Top 0.406: R2.2 7.62,2.59 10.06,5.03 OK1.1
N$2
  Top 0.406: R18.1 43.28,68.58 43.28,46.79 44.35,45.72 Q1.1
N$3
  Top 0.406: R19.2 39.32,68.58 39.32,52.27 33.07,46.02 33.07,45.72 Q2.1
N$4
  Top 0.406: R20.2 27.89,68.58 27.89,52.27 21.64,46.02 21.64,45.72 T9.1
N$5  (via drill 0.61)
  Top 0.635: T9.2 24.23,45.72 24.23,45.26 26.06,43.43 33.68,43.43 35.51,45.26 35.51,45.72 Q2.2 35.66,45.11 38.25,42.52 57,42.52 57.61,43.13 v61.27,43.13
  Bottom 0.635: v61.27,43.13 63.86,45.72 63.86,61.87 69.34,67.36 71.78,67.36 72.54,68.12 83.97,68.12 90.22,74.37 90.22,79.86 94.94,84.58 94.94,86.26 MOTOROUT.2
N$6  (via drill 0.61)
  Top 0.635: Q1.2 47.09,45.72 47.09,45.26 48.92,43.43 56.54,43.43 58.37,45.26 58.37,45.72 T10.2 | v87.48,81.23 94.94,81.23 MOTOROUT.1
  Bottom 0.635: v87.48,81.23 85.65,81.23 79.4,74.98 76.96,74.98 76.2,74.22 76.2,73.15 71.32,68.28 68.89,68.28 62.94,62.33 62.94,50.6 58.52,46.18 58.52,45.72 T10.2
N$7
  Top 0.406: LEDP0.A 69.95,62.33 69.95,65.99 R21.1
N$8
  Top 0.406: R17.1 54.71,68.58 54.71,46.79 55.78,45.72 T10.1
N$9
  Top 0.406: R22.1 72.39,64.77 LEDP1.A
N$10
  Top 0.406: R4.2 17.83,5.18 21.49,5.18 OK2.1
N$11
  Top 0.406: R23.1 74.98,65.99 75.89,65.99 79.55,62.33 80.01,62.33 LEDP2.A
N$12
  Top 0.635: OK1.4 15.24,15.24 R1.1
N$13
  Top 0.635: T1.1 8.99,20.42 8.99,16.61 R1.2
N$14
  Bottom 0.406: LEDP3.A 85.04,62.33 83.97,62.33 81.38,64.92 78.64,64.92 77.57,65.99 R24.1
N$15
  Top 0.406: LEDP4.A 70.87,57.15 71.93,56.08 85.65,56.08 86.56,57 86.56,64.92 87.63,65.99 R28.1
N$16
  Top 0.635: OK2.4 26.67,15.24 R3.1
N$17
  Top 0.635: T2.1 20.42,20.42 20.42,16.61 R3.2
N$18
  Bottom 0.406: LEDP5.A 75.89,57.15 79.86,61.11 85.5,61.11 86.26,61.87 86.26,64.92 85.19,65.99 R27.1
N$19
  Top 0.406: R6.2 29.26,5.18 32.92,5.18 OK3.1
N$20
  Top 0.406: LEDP6.A 80.01,60.66 81.38,62.03 81.38,64.92 82.45,65.99 R26.1
N$21
  Top 0.635: OK3.4 38.1,15.24 R5.1
N$22
  Bottom 0.635: T3.1 31.85,20.42 31.85,16.61 R5.2
N$23
  Top 0.406: R25.1 80.01,66.14 81.08,66.14 82.14,67.21 82.91,67.21 83.97,66.14 83.97,58.22 85.04,57.15 LEDP7.A
N$24
  Bottom 0.406: OK4.1 40.69,8.84 40.69,12.65 R8.2
N$25
  Bottom 0.406: LED5V.A 77.42,78.79 78.64,78.79 R30.1
N$26
  Top 0.635: OK4.4 49.53,15.24 R7.1
N$27
  Top 0.635: T4.1 43.28,20.42 43.28,16.61 R7.2
N$28
  Top 0.406: R29.1 81.38,78.79 81.38,80.01 83.82,82.45 LED24V.A
N$29
  Top 0.406: R10.2 52.12,5.18 55.78,5.18 OK5.1
N$31
  Top 0.635: OK5.4 60.96,15.24 R9.1
N$32
  Top 0.635: T5.1 54.71,20.42 54.71,16.61 R9.2
N$34
  Top 0.406: OK6.1 63.55,8.84 63.55,12.65 R12.2
N$36
  Top 0.635: OK6.4 72.39,15.24 R11.1
N$37
  Top 0.635: T6.1 66.14,20.42 66.14,16.61 R11.2
N$39
  Top 0.406: OK7.1 74.98,8.84 74.98,12.65 R14.2
N$41
  Top 0.635: OK7.4 83.82,15.24 R13.1
N$42
  Top 0.635: T7.1 77.57,20.42 77.57,16.61 R13.2
N$44
  Top 0.406: OK8.1 86.41,8.84 86.41,12.65 R16.2
N$46
  Top 0.635: OK8.4 95.25,15.24 R15.1
N$47
  Top 0.635: T8.1 89,20.42 89,16.61 R15.2
P0  (via drill 0.61)
  Top 0.406: v75.59,34.14 75.59,43.28 77.42,45.11 77.42,45.72 MODULO_I2C.4 | v74.37,60.5 72.69,62.18 72.39,62.18 LEDP0.K
  Bottom 0.406: v75.59,34.14 75.59,22.1 68.73,15.24 68.73,12.5 62.33,6.1 62.33,3.5 60.81,1.98 15.39,1.98 12.8,4.57 12.8,5.03 OK1.2 | v74.37,60.5 74.37,58.22 73.76,57.61 73.76,49.38 77.42,45.72 MODULO_I2C.4
P1  (via drill 0.61)
  Top 0.406: v24.23,11.12 24.23,5.18 OK2.2 | v33.07,27.74 54.41,27.74 70.56,43.89 75.29,43.89 76.35,44.96 76.35,46.79 77.11,47.55 | 77.11,47.55 78.18,47.55 MODULO_I2C.5 | LEDP1.K 73.46,58.22 69.34,58.22 68.73,57.61 68.73,56.69 69.34,56.08 71.02,56.08 71.93,55.17 75.29,55.17 76.35,54.1 76.35,48.46 77.11,47.7 77.11,47.55
  Bottom 0.406: v24.23,11.12 25.45,12.34 25.45,17.68 33.07,25.3 v33.07,27.74
P2  (via drill 0.61)
  Top 0.406: v76.5,36.42 76.5,39.78 82.45,45.72 MODULO_I2C.6 | v83.06,60.2 82.6,60.66 82.6,62.18 LEDP2.K
  Bottom 0.406: v76.5,36.42 64.92,24.84 64.92,12.5 59.89,7.47 59.89,3.66 58.83,2.59 37.64,2.59 35.66,4.57 35.66,5.03 OK3.2 | v83.06,60.2 83.67,60.2 86.26,57.61 86.26,49.38 82.6,45.72 MODULO_I2C.6
P3
  Top 0.406: OK4.2 47.09,5.03 47.09,4.57 49.68,1.98 89.92,1.98 91.29,3.35 91.29,10.06 87.78,13.56 87.78,43.13 85.19,45.72 MODULO_I2C.7 85.19,45.87 85.19,47.4 88.7,50.9 88.7,57.61 87.63,58.67 LEDP3.K
P4
  Bottom 0.406: OK5.2 58.52,5.18 58.52,11.12 59.74,12.34 59.74,15.7 64.31,20.27 64.31,44.96 71.32,51.97 71.32,56.08 LEDP4.K 72.39,57.3 73.46,58.37 73.46,62.33 76.05,64.92 76.05,66.14 77.11,67.21 85.5,67.21 86.26,66.45 86.26,65.84 88.7,63.4 88.7,56.69 87.63,55.63 MODULO_I2C.9
P5
  Bottom 0.406: OK6.2 69.95,5.18 69.95,6.1 76.35,12.5 76.35,33.53 77.42,34.59 77.42,36.88 76.81,37.49 76.81,42.82 78.64,44.65 78.64,56.08 77.57,57.15 LEDP5.K 78.03,56.84 79.4,58.22 83.06,58.22 83.67,57.61 83.67,57 85.04,55.63 85.04,53.34 MODULO_I2C.10
P6
  Top 0.406: OK7.2 81.38,5.18 81.38,8.53 85.19,12.34 85.19,14.94 87.17,16.92 87.17,41.45 83.67,44.96 83.67,52.27 82.6,53.34 MODULO_I2C.11
  Bottom 0.406: LEDP6.K 82.6,57.15 82.6,53.34 MODULO_I2C.11
P7
  Top 0.406: MODULO_I2C.12 80.31,53.34 82.45,55.47 85.95,55.47 LEDP7.K
  Bottom 0.406: MODULO_I2C.12 81.08,52.27 81.08,44.96 82.14,43.89 82.75,43.89 85.8,40.84 85.8,20.88 80.16,15.24 80.16,12.19 81.84,10.52 86.26,10.52 91.59,5.18 92.66,5.18 OK8.2
S0
  Top 0.635: T1.3 15.24,21.95 9.6,27.58 9.6,39.01 7.47,41.15 7.47,45.11 8.84,46.48 8.84,54.56 D1.C
  Bottom 0.635: T1.3 15.24,21.18 12.8,18.75 5.18,18.75 SALIDAS_POT.1
S1  (via drill 0.61)
  Top 0.635: v17.53,39.17 17.53,38.86 26.67,29.72 T2.3
  Bottom 0.635: T2.3 26.67,21.95 24.69,23.93 9.6,23.93 7.16,21.49 5.18,21.49 SALIDAS_POT.2 | v17.53,39.17 18.59,40.23 18.59,55.93 8.99,65.53 8.99,67.21 D2.C
S2  (via drill 0.61)
  Top 0.635: v6.55,70.71 8.84,73 8.84,80.01 D3.C | v17.37,47.09 22.25,42.22 25.3,42.22 32.61,34.9 v32.61,29.26
  Bottom 0.635: 32.61,28.96 30.02,26.36 10.67,26.36 8.53,24.23 5.18,24.23 SALIDAS_POT.3 | 32.61,28.96 33.53,28.96 38.1,24.38 T3.3 | v6.55,70.71 6.55,66.6 17.37,55.78 v17.37,47.09 | v32.61,29.26 32.61,28.96
S3  (via drill 0.61)
  Top 0.635: T4.3 49.53,21.95 47.55,23.93 42.52,23.93 40.84,25.6 29.87,25.6 v27.89,27.58
  Bottom 0.635: D4.C 11.43,54.56 7.47,50.6 7.47,35.81 3.66,32 3.66,29.11 5.03,27.74 5.03,26.98 SALIDAS_POT.4 5.33,27.28 8.69,27.28 8.99,27.58 v27.89,27.58
S4
  Bottom 0.635: 18.44,38.41 19.51,39.47 19.51,59.13 11.43,67.21 D5.C | 18.44,38.41 9.75,29.72 5.18,29.72 SALIDAS_POT.5 | T5.3 60.96,21.18 58.98,19.2 43.89,19.2 40.54,22.55 40.54,24.69 30.63,34.59 22.25,34.59 18.44,38.41
S5  (via drill 0.61)
  Top 0.635: v9.75,11.28 2.59,18.44 2.59,19.96 SALIDAS_POT.6 | v59.74,17.07 60.96,17.07 61.72,17.83 62.94,17.83 65.53,15.24 66.6,15.24 v68.73,17.37 | v21.03,54.25 21.03,63.55 12.8,71.78 12.8,80.01 D6.C | v41.76,15.54 v41.76,23.01
  Bottom 0.635: v9.75,11.28 17.98,11.28 19.96,9.3 27.58,9.3 31.7,13.41 31.7,14.48 32.61,15.39 38.71,15.39 38.86,15.24 41.76,15.24 | 41.76,15.24 43.89,15.24 44.04,15.39 50.14,15.39 50.29,15.24 55.32,15.24 57.15,17.07 v59.74,17.07 | v68.73,17.37 72.39,21.03 T6.3 | v21.03,54.25 30.94,44.35 30.94,35.66 41.76,24.84 v41.76,23.01 | v41.76,15.54 41.76,15.24
S6  (via drill 0.61)
  Top 0.635: v14.33,17.83 16.76,20.27 16.76,38.25 15.7,39.32 15.7,40.39 | 15.7,40.39 15.7,52.88 D7.C | T7.3 83.82,21.95 80.92,24.84 42.98,24.84 41.3,26.52 31.85,26.52 17.98,40.39 15.7,40.39
  Bottom 0.635: v14.33,17.83 8.38,17.83 7.77,17.22 4.57,17.22 3.66,18.14 3.66,19.2 3.96,19.51 3.96,20.57 2.59,21.95 2.59,22.71 SALIDAS_POT.7
S7  (via drill 0.61)
  Top 0.635: 3.66,31.09 3.66,32 7.01,35.36 7.01,40.23 6.55,40.69 6.55,48.01 7.47,48.92 7.47,60.81 D8.C | 3.66,31.09 3.66,29.11 3.96,28.8 3.96,27.74 2.59,26.36 2.59,25.6 SALIDAS_POT.8 | v86.11,19.81 86.11,22.25 82.3,26.06 v63.25,26.06 | v8.23,28.5 5.64,31.09 3.66,31.09
  Bottom 0.635: T8.3 95.25,21.18 93.27,19.2 86.72,19.2 v86.11,19.81 | v63.25,26.06 63.25,21.03 60.5,18.29 43.43,18.29 39.62,22.1 39.62,24.23 33.38,30.48 11.89,30.48 9.91,28.5 v8.23,28.5
SCL  (via drill 0.61)
  Top 0.406: v55.63,51.51 73,51.51 74.83,53.34 MODULO_I2C.14
  Bottom 0.406: v55.63,51.51 41,51.51 28.5,64.01 28.5,66.14 12.95,81.69 12.19,81.69 10.82,83.06 10.82,86.26 12.19,87.63 15.7,87.63 16.61,86.72 16.61,85.04 17.83,83.82 RPI_HEADER.5
SDA
  Top 0.406: MODULO_I2C.15 72.08,53.34 69.95,55.47 69.04,55.47 61.42,63.09 61.42,64.31 55.02,70.71 17.53,70.71 14.78,73.46 14.78,83.36 RPI_HEADER.3

### Text on the board
Top: + | - | SMARTBENDER 2.0 | BORBOLLA | B | A | - | +